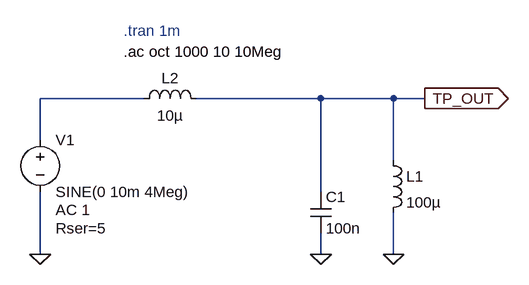
[diagram p0: schematic 4020 Audio Output Filter 1.asc]
4020 Audio Output Filter 1.asc, the LTspice schematic file:
Version 4
SHEET 1 880 680
WIRE 80 -112 -80 -112
WIRE 352 -112 160 -112
WIRE 464 -112 352 -112
WIRE 512 -112 464 -112
WIRE -80 -48 -80 -112
WIRE 464 -16 464 -112
WIRE 352 32 352 -112
WIRE -80 128 -80 32
WIRE 352 128 352 96
WIRE 464 128 464 64
FLAG -80 128 0
FLAG 464 128 0
FLAG 512 -112 TP_OUT
IOPIN 512 -112 Out
FLAG 352 128 0
SYMBOL voltage -80 -64 R0
WINDOW 123 24 124 Left 2
WINDOW 39 24 152 Left 2
SYMATTR Value2 AC 1
SYMATTR SpiceLine Rser=5
SYMATTR InstName V1
SYMATTR Value SINE(0 10m 4Meg)
SYMBOL ind 448 -32 R0
SYMATTR InstName L1
SYMATTR Value 100µ
SYMATTR SpiceLine Rser=16
SYMBOL ind 64 -96 R270
WINDOW 0 32 56 VTop 2
WINDOW 3 5 56 VBottom 2
SYMATTR InstName L2
SYMATTR Value 10µ
SYMBOL cap 336 32 R0
SYMATTR InstName C1
SYMATTR Value 100n
TEXT 48 -216 Left 2 ;.tran 1m
TEXT 48 -184 Left 2 !.ac oct 1000 10 10Meg

The netlist it stands for:
* 4020 Audio Output Filter 1.asc
V1 N001 0 SINE(0 10m 4Meg) AC 1 Rser=5
L1 TP_OUT 0 100µ Rser=16
L2 N001 TP_OUT 10µ
C1 TP_OUT 0 100n
* .tran 1m
.ac oct 1000 10 10Meg
.backanno
.end